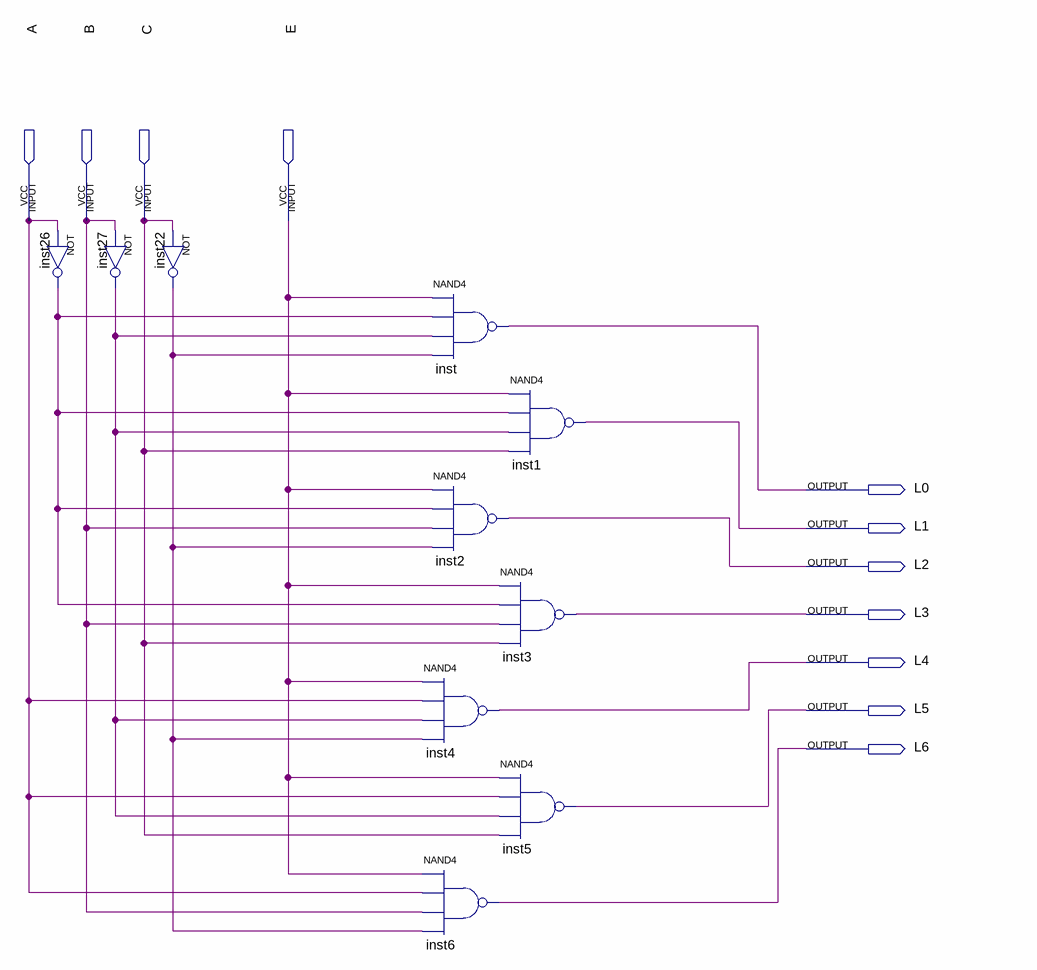
[diagram p0: schematic sheet]
// Quartus schematic DECODIFICADOR_LINHAS.bdf as structural Verilog: 10 symbols, 11 pins
module DECODIFICADOR_LINHAS (
  input  A,
  input  B,
  input  C,
  input  E,
  output L0,
  output L1,
  output L2,
  output L3,
  output L4,
  output L5,
  output L6
);

  wire inst22_out, inst26_out, inst27_out;

  not inst26 (inst26_out, A);
  not inst27 (inst27_out, B);
  not inst22 (inst22_out, C);
  nand inst4 (L4, E, A, inst27_out, inst22_out);
  nand inst6 (L6, E, A, B, inst22_out);
  nand inst (L0, E, inst26_out, inst27_out, inst22_out);
  nand inst2 (L2, E, inst26_out, B, inst22_out);
  nand inst3 (L3, E, inst26_out, B, C);
  nand inst5 (L5, E, A, inst27_out, C);
  nand inst1 (L1, E, inst26_out, inst27_out, C);
endmodule
